# EAGLE design UnipolarMotor (EAGLE 7.2.0)
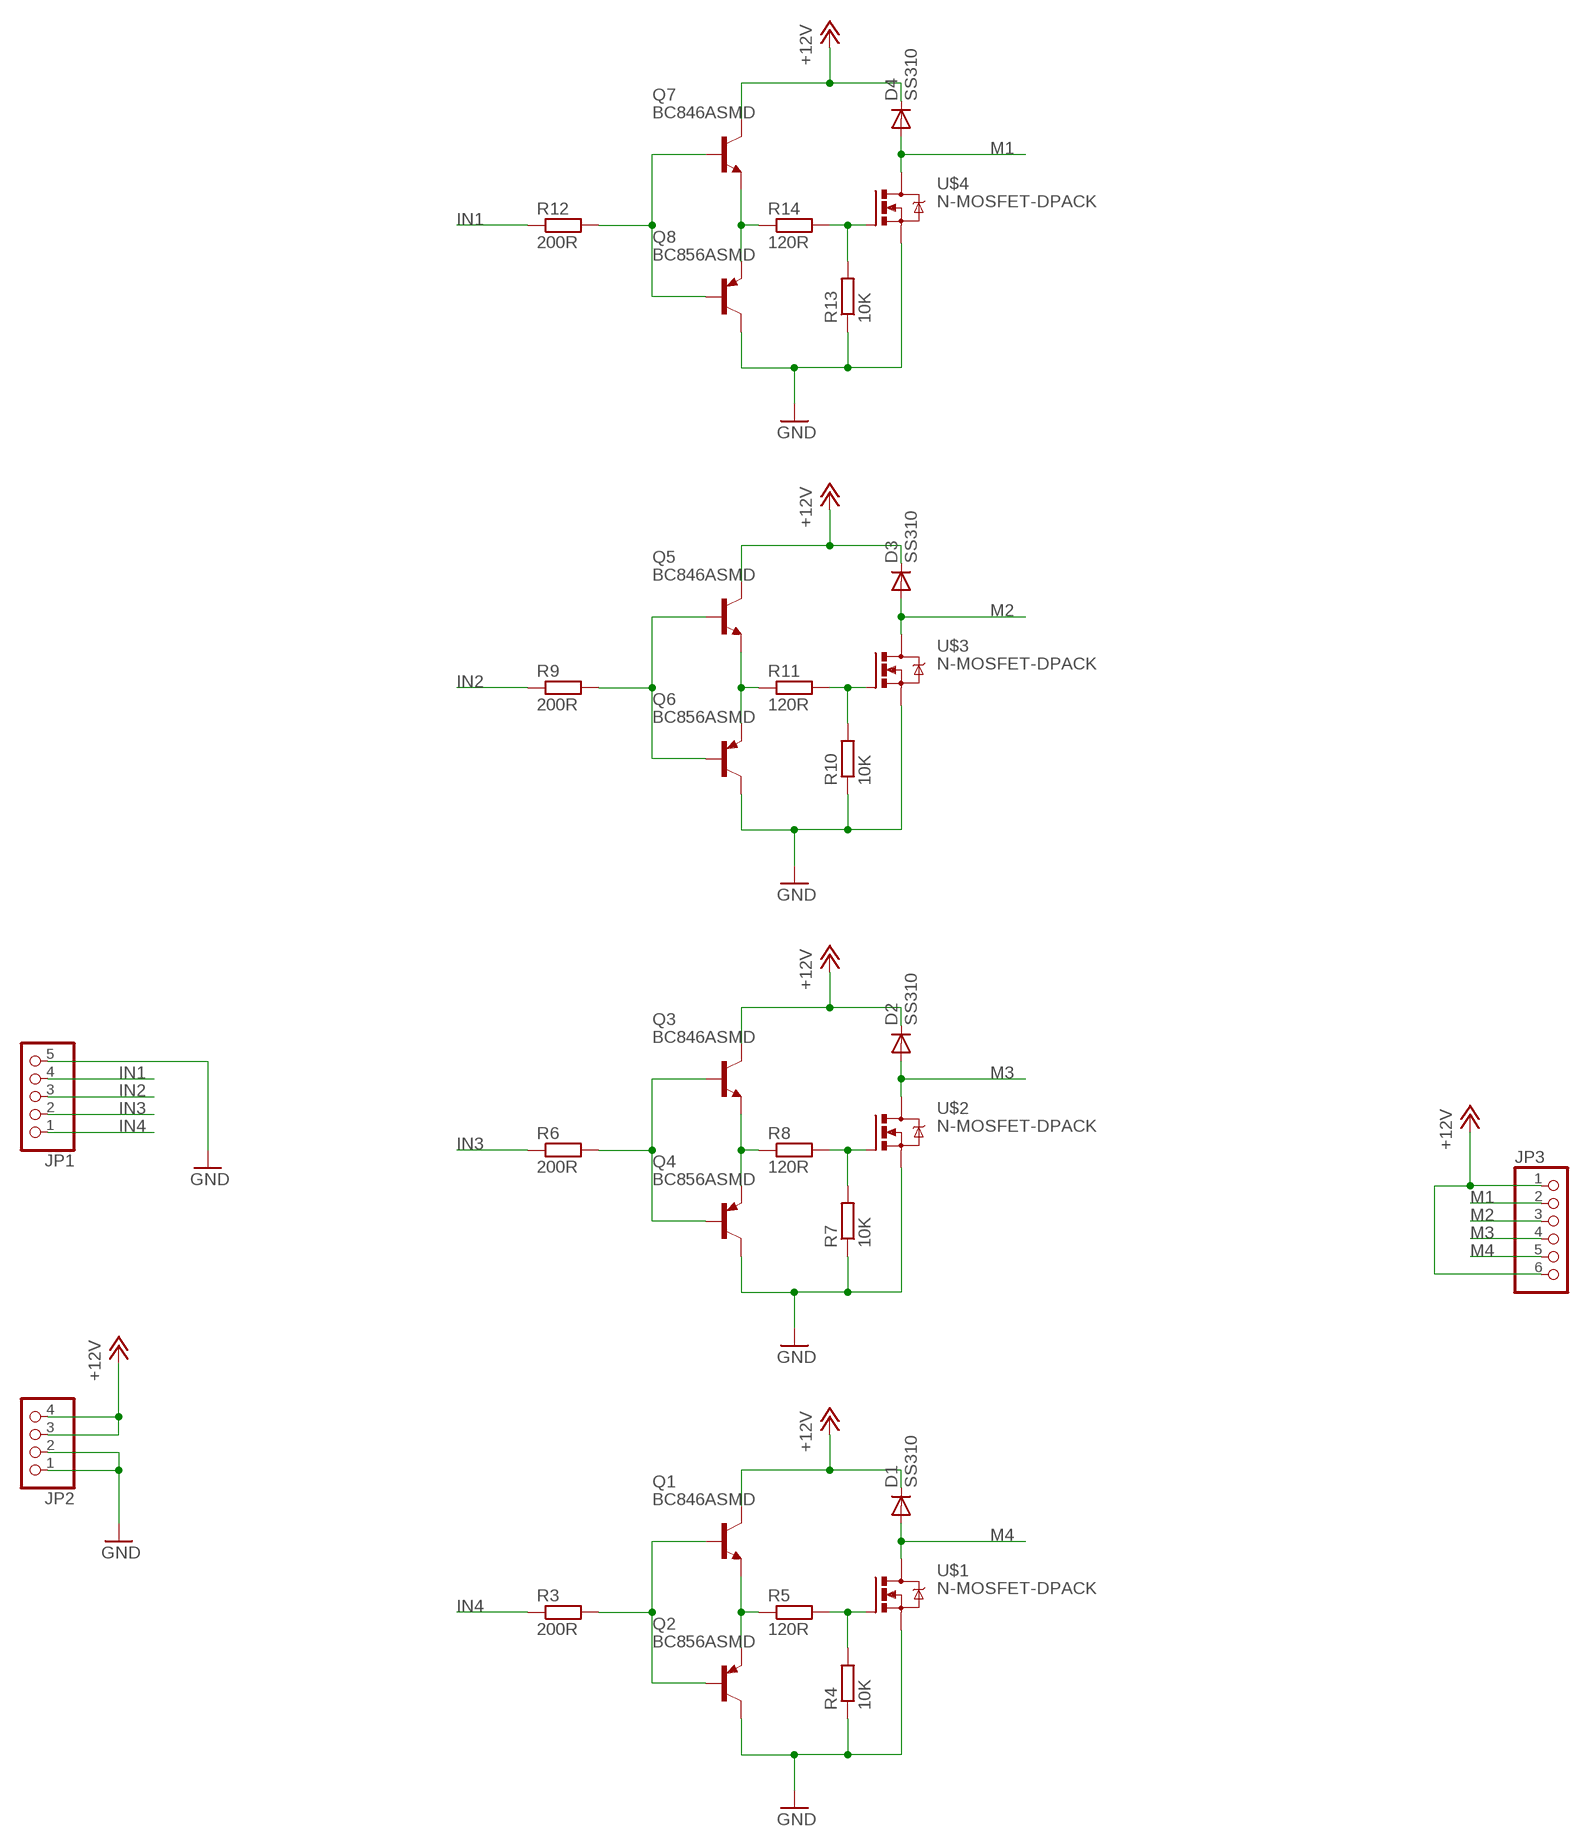
[diagram p0: schematic, sheet 1]

## Parts
D1  SS310  DIODESMA-ALT  [SMA-DIODE_ALT]
D2  SS310  DIODESMA-ALT  [SMA-DIODE_ALT]
D3  SS310  DIODESMA-ALT  [SMA-DIODE_ALT]
D4  SS310  DIODESMA-ALT  [SMA-DIODE_ALT]
JP1  PINHD-1X5  [1X05]
JP2  PINHD-1X4  [1X04]
JP3  PINHD-1X6  [1X06]
Q1  BC846ASMD  [SOT23]
Q2  BC856ASMD  [SOT23-BEC]
Q3  BC846ASMD  [SOT23]
Q4  BC856ASMD  [SOT23-BEC]
Q5  BC846ASMD  [SOT23]
Q6  BC856ASMD  [SOT23-BEC]
Q7  BC846ASMD  [SOT23]
Q8  BC856ASMD  [SOT23-BEC]
R3  200R  R-EU_0204/7  [0204/7]
R4  10K  R-EU_R0805  [R0805]
R5  120R  R-EU_R0805  [R0805]
R6  200R  R-EU_0204/7  [0204/7]
R7  10K  R-EU_R0805  [R0805]
R8  120R  R-EU_R0805  [R0805]
R9  200R  R-EU_0204/7  [0204/7]
R10  10K  R-EU_R0805  [R0805]
R11  120R  R-EU_R0805  [R0805]
R12  200R  R-EU_0204/7  [0204/7]
R13  10K  R-EU_R0805  [R0805]
R14  120R  R-EU_R0805  [R0805]
U$1  N-MOSFET-DPACK  [DPACK]
U$2  N-MOSFET-DPACK  [DPACK]
U$3  N-MOSFET-DPACK  [DPACK]
U$4  N-MOSFET-DPACK  [DPACK]

## Nets
+12V: D1.C D2.C D3.C D4.C JP2.3 JP2.4 JP3.1 JP3.6 Q1.3(C) Q3.3(C) Q5.3(C) Q7.3(C)
GND: JP1.5 JP2.1 JP2.2 Q2.C Q4.C Q6.C Q8.C R4.1 R7.1 R10.1 R13.1 U$1.3(S) U$2.3(S) U$3.3(S) U$4.3(S)
IN1: JP1.4 R12.1
IN2: JP1.3 R9.1
IN3: JP1.2 R6.1
IN4: JP1.1 R3.1
M1: D4.A JP3.2 U$4.2(D)
M2: D3.A JP3.3 U$3.2(D)
M3: D2.A JP3.4 U$2.2(D)
M4: D1.A JP3.5 U$1.2(D)
N$1: Q1.2(E) Q2.E R5.1
N$2: R4.2 R5.2 U$1.1(G)
N$5: Q1.1(B) Q2.B R3.2
N$7: Q3.2(E) Q4.E R8.1
N$8: R7.2 R8.2 U$2.1(G)
N$10: Q3.1(B) Q4.B R6.2
N$12: Q5.2(E) Q6.E R11.1
N$13: R10.2 R11.2 U$3.1(G)
N$15: Q5.1(B) Q6.B R9.2
N$17: Q7.2(E) Q8.E R14.1
N$18: R13.2 R14.2 U$4.1(G)
N$20: Q7.1(B) Q8.B R12.2

## Library data of the parts
D1-D4 = SparkFun:DIODE: Diode These are standard reverse protection diodes and small signal diodes. SMA package can handle up to about 1A. SOD-323 can handle about 200mA. What the SOD-323 package when ordering, there are some mfgs out there that are 5-pin packages.
JP1 = pinhead:PINHD-1X5: PIN HEADER
JP2 = pinhead:PINHD-1X4: PIN HEADER
JP3 = pinhead:PINHD-1X6: PIN HEADER
Q1 Q3 Q5 Q7 = transistor-npn:BC846*: NPN Transistor
Q2 Q4 Q6 Q8 = transistor-pnp:BC856*: PNP Transistror
R3-R14 = rcl:R-EU_: RESISTOR, European symbol
U$1-U$4 = sergey:N-MOSFET-DPACK

## Board
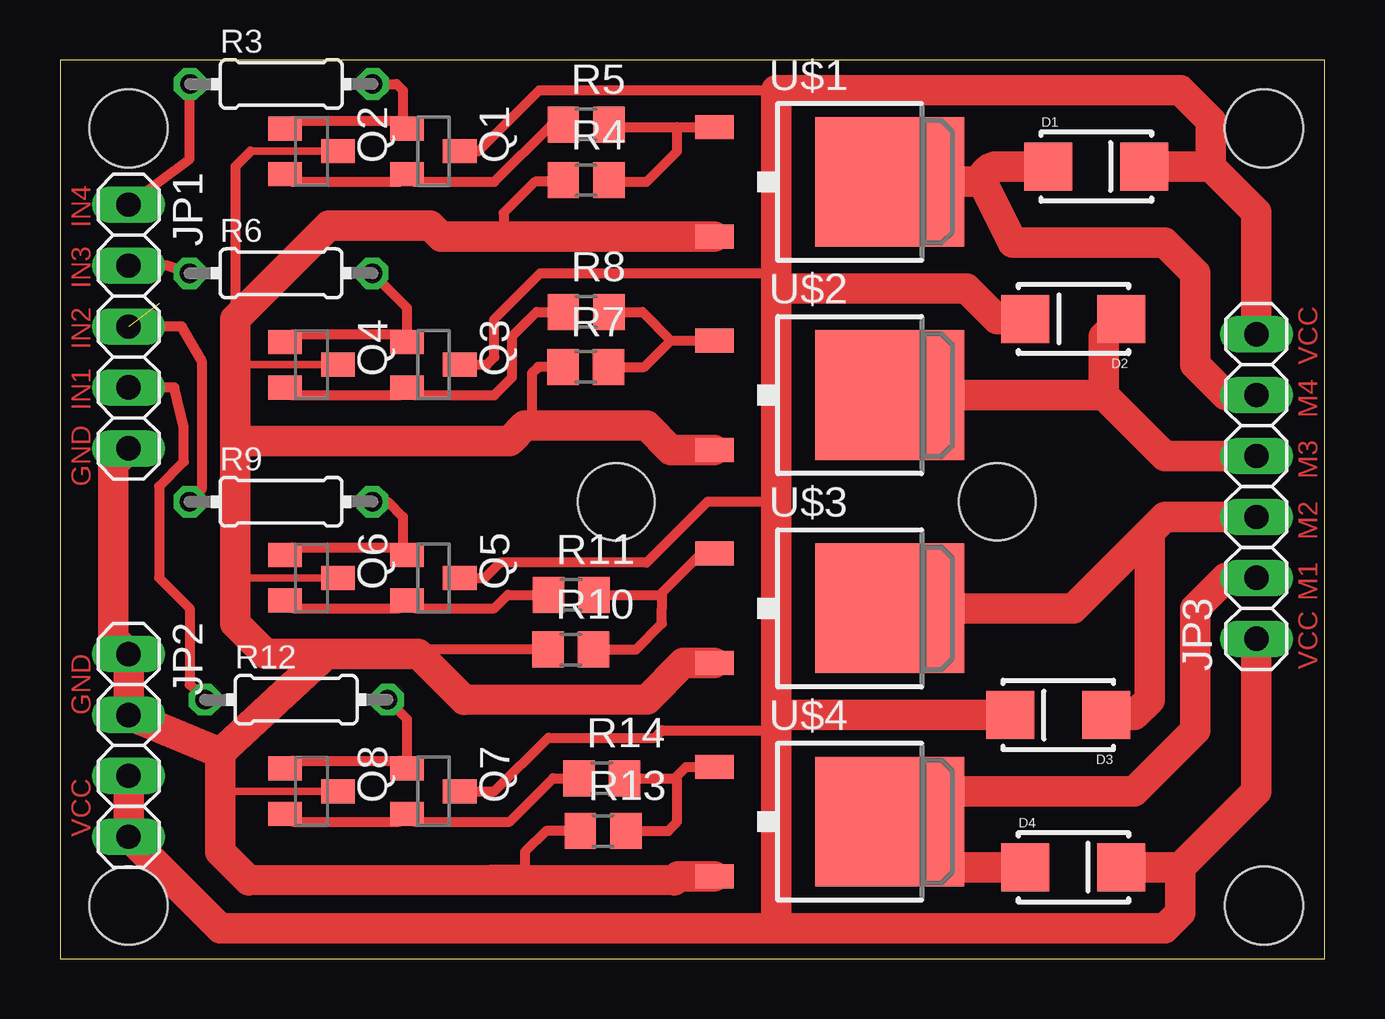
[diagram p1: board, top side]

Size 52.69 x 37.45 mm. Coordinates in mm from the lower left corner, seen from the top.
Outline: 0,0 52.69,0 52.69,37.45 0,37.45 0,0
Copper layers (1*16): Top 0.035mm / dielectric 1.5mm / Bottom 0.035mm
Design rules "default *": minimum track width 10mil, minimum drill 24mil, track to track 20mil, track to pad 20mil, pad to pad 8mil, via to via 8mil, smd to smd 8mil, copper to edge 20mil, drill to drill 10mil, minimum pad ring 10mil, minimum via ring 8mil, stop-mask expansion 4mil, vias tented up to drill 0mil, thermal gap 10mil
Holes 3.2 mm at 39.05,19.05 23.18,19.05
Holes 3.25 mm at 2.86,34.61 50.16,34.61 50.16,2.22 2.86,2.22

### Footprints (pad centres in the part's own frame; a part is rotated, then mirrored left to right if it is on the bottom)
SMA-DIODE_ALT = smd 2 x 2: A -2,0; C 2,0
1X05 = drill 1.016 long: 1 -5.08,0; 2 -2.54,0; 3 0,0; 4 2.54,0; 5 5.08,0
1X04 = drill 1.016 long: 1 -3.81,0; 2 -1.27,0; 3 1.27,0; 4 3.81,0
1X06 = drill 1.016 long: 1 -6.35,0; 2 -3.81,0; 3 -1.27,0; 4 1.27,0; 5 3.81,0; 6 6.35,0
SOT23 = smd 1 x 1.4: 1 -0.95,-1.1; 2 0.95,-1.1; 3 0,1.1
SOT23-BEC = smd 1 x 1.4: B -0.95,-1.1; C 0,1.1; E 0.95,-1.1
0204/7 = drill 0.813 octagon: 1 -3.81,0; 2 3.81,0
R0805 = smd 1.3 x 1.5: 1 -0.95,0; 2 0.95,0
DPACK = smd 1 x 1.6: 1 -2.28,-6.07; 3 2.28,-6.07 | smd 5.4 x 6.2: 2 0,1.23

### Placement (x,y rotation side)
D1  43.18,33.02 0 top
D2  42.23,26.67 180 top
D3  41.59,10.16 180 top
D4  42.23,3.81 0 top
JP1  2.86,26.35 270 top
JP2  2.86,8.89 270 top
JP3  49.85,19.69 90 top
Q1  15.56,33.66 270 top
Q2  10.48,33.66 270 top
Q3  15.56,24.77 270 top
Q4  10.48,24.77 270 top
Q5  15.56,15.88 270 top
Q6  10.48,15.88 270 top
Q7  15.56,6.98 270 top
Q8  10.48,6.98 270 top
R3  9.22,36.46 0 top
R4  21.92,32.45 0 top
R5  21.92,34.77 0 top
R6  9.21,28.58 0 top
R7  21.91,24.67 0 top
R8  21.92,26.96 0 top
R9  9.21,19.05 0 top
R10  21.28,12.89 0 top
R11  21.3,15.17 0 top
R12  9.84,10.79 0 top
R13  22.63,5.33 0 top
R14  22.57,7.53 0 top
U$1  33.34,32.38 270 top
U$2  33.34,23.5 270 top
U$3  33.34,14.61 270 top
U$4  33.34,5.71 270 top

### Tracks (layer width: path | path; a pad name or v marks a point on that pad's centre or on a via)
+12V
  Top 0.406: Q5.3 17.7,15.88 18.34,16.51 24.45,16.51 26.99,19.05 29.84,19.05 | Q7.3 18.1,6.98 20.34,9.21 24.79,9.21 25.08,9.53 29.84,9.53 | 29.84,36.2 19.96,36.2 17.42,33.66 Q1.3 | 29.84,28.58 20,28.58 18.1,26.67 18.1,25.07 17.79,24.76 Q3.3
  Top 1.27: 29.84,1.27 6.67,1.27 JP2.4 JP2.3 | 29.84,1.27 46.04,1.27 46.67,1.91 46.67,3.81 | 29.84,27.94 29.84,19.05 29.84,10.16 | 29.84,27.94 29.84,28.58 29.84,36.2 46.67,36.2 47.94,34.92 47.94,33.34 47.78,33.18 | D3.C 29.84,10.16 | D4.C 46.67,3.81 | D2.C 39.05,26.67 37.78,27.94 29.84,27.94 | D1.C 47.62,33.02 47.78,33.18 | 29.84,1.27 29.84,9.53 29.84,10.16 | JP3.6 49.85,31.12 47.78,33.18 | JP3.1 49.85,6.98 46.67,3.81
GND
  Top 0.305: Q2.C 7.94,33.66 | Q4.C 7.3,24.77 | Q6.C 7.3,15.88 | Q8.C 6.67,6.98
  Top 0.406: 18.06,3.7 18,3.28 | 7.94,33.66 7.3,33.02 7.3,26.67 | R10.1 14.92,12.89 14.92,12.7 | R13.1 20.25,5.33 19.37,4.45 19.37,3.28 19.36,3.28 | R4.1 20.91,32.39 19.79,32.39 18.49,31.09 18.49,30.11 | R7.1 19.92,24.67 19.66,24.41 19.66,22.52 19.37,22.23
  Top 1.27: U$3.3 25.98,12.32 24.48,10.8 16.84,10.78 14.92,12.7 11.11,12.7 | 7.3,21.59 18.73,21.59 19.37,22.23 24.45,22.23 25.46,21.21 U$2.3 | 6.67,8.57 JP2.2 JP2.1 2.21,13.35 2.21,20.63 JP1.5 | 6.67,8.57 6.67,6.98 6.67,4.45 7.87,3.26 18,3.28 19.36,3.28 25.6,3.26 25.77,3.43 U$4.3 | 7.3,21.59 7.3,24.77 7.3,26.67 11.19,30.56 15.44,30.56 15.89,30.11 18.49,30.11 U$1.3 | 7.3,21.59 7.3,15.88 7.3,13.97 8.57,12.7 11.11,12.7 | 11.11,12.7 6.67,8.57
IN1
  Top 0.406: JP1.4 4.76,23.81 5.15,22.16 5.16,20.72 4.13,19.69 4.13,15.88 5.4,14.61 5.4,11.43 R12.1
IN2  (1 unrouted)
  Top 0.406: JP1.3 5.08,26.35 5.9,24.93 5.9,19.55 R9.1
IN3
  Top 0.406: R6.1 4.45,28.89 JP1.2
IN4
  Top 0.406: JP1.1 5.4,33.34 5.4,36.45 R3.1
M1
  Top 0.61: 36.47,3.81 35.22,5.06 U$4.2
  Top 1.27: JP3.2 48.58,15.88 47.31,14.61 47.31,9.53 44.77,6.98 37.15,6.98 arc90 35.22,5.06 | D4.A 36.47,3.81
M2
  Top 1.27: U$3.2 42.23,14.61 45.4,17.78 | 45.4,17.78 46.04,18.42 JP3.3 | D3.A 44.77,10.16 45.4,10.79 45.4,17.78
M3
  Top 1.27: U$2.2 43.5,23.5 | 43.5,23.5 46.04,20.96 JP3.4 | D2.A 43.5,25.94 43.5,23.5
M4
  Top 1.27: U$1.2 38.42,32.38 | JP3.5 48.58,23.5 47.31,24.77 47.31,28.58 46.04,29.85 39.69,29.85 38.42,32.38 | D1.A 39.05,33.02 arc90 38.42,32.38
N$1
  Top 0.406: Q2.E 9.7,32.38 14.14,32.38 Q1.2 14.78,32.38 18.1,32.38 20.48,34.77 R5.1
N$2
  Top 0.406: R5.2 22.98,34.66 25.72,34.66 | 25.72,34.66 U$1.1 | R4.2 22.94,32.38 24.45,32.38 25.72,33.66 25.72,34.66
N$3  (via drill 0.6)
  other vias: 23.18,19.05
N$4  (via drill 0.6)
  other vias: 39.05,19.05
N$5
  Top 0.406: Q2.B 9.7,34.92 14.14,34.92 Q1.1 | 14.46,34.75 Q1.1 | R3.2 14.02,36.46 14.29,36.2 14.29,34.77 Q1.1
N$6  (via drill 0.6)
  other vias: 2.86,2.22
N$7
  Top 0.406: Q4.E 9.7,23.5 14.14,23.5 arc90 Q3.2 14.78,23.5 18.1,23.5 18.84,24.24 18.84,25.95 19.85,26.96 R8.1
N$8
  Top 0.406: 25.46,25.78 U$2.1 | R8.2 24.28,26.96 25.46,25.78 | R7.2 24.35,24.67 25.46,25.78
N$9  (via drill 0.6)
  other vias: 2.86,34.61
N$10
  Top 0.406: Q4.B 9.7,26.04 14.14,26.04 Q3.1 14.46,27.14 R6.2
N$11  (via drill 0.6)
  other vias: 50.16,34.61
N$12
  Top 0.406: Q6.E 9.7,14.61 14.14,14.61 Q5.2 14.78,14.61 18.1,14.61 18.66,15.17 R11.1
N$13
  Top 0.406: U$3.1 26.73,16.89 25.08,15.24 25.08,15.17 | R10.2 24,12.89 25.08,13.97 25.08,14.61 25.08,15.17 | R11.2 25.08,15.17
N$14  (via drill 0.6)
  other vias: 50.16,2.22
N$15
  Top 0.406: Q6.B 9.7,17.15 14.14,17.15 Q5.1 14.29,17 14.29,18.42 13.65,19.05 R9.2
N$17
  Top 0.406: Q8.E 9.7,5.71 14.14,5.71 Q7.2 14.78,5.71 18.73,5.71 20.54,7.53 R14.1
N$18
  Top 0.406: U$4.1 26.09,8 25.62,7.53 | R14.2 25.62,7.53 | R13.2 25.35,5.33 25.72,5.71 25.72,7.43 25.62,7.53
N$20
  Top 0.406: Q8.B 9.7,8.26 14.14,8.26 arc-90 Q7.1 14.46,9.99 R12.2

### Text on the board
Top: IN4 | IN3 | IN2 | VCC | IN1 | M4 | GND | M3 | M2 | M1 | VCC | GND | VCC